# Altium schematic sheet sensor_connector.SchDoc
size A4; SheetNumber: 6; SheetTotal: 12
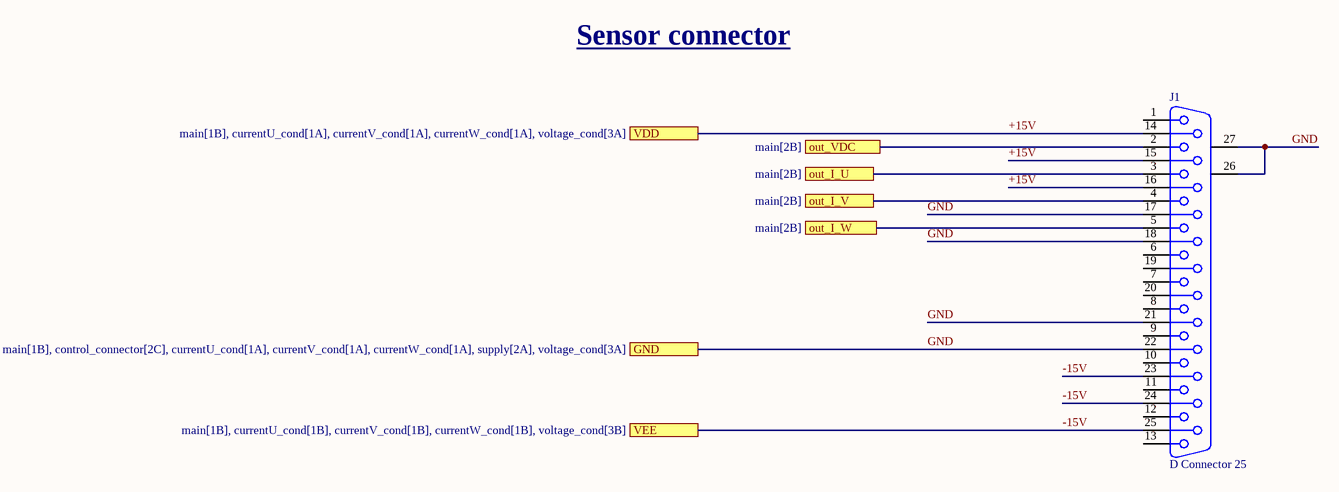
[diagram p0: sensor_connector.SchDoc]

## Parts
J1  D Connector 25  [DSUB1.385-2H25A_mod]

## Ports
GND (see main[1B], control_connector[2C], currentU_cond[1A], currentV_cond[1A], currentW_cond[1A], supply[2A], voltage_cond[3A]), out_I_U (see main[2B]), out_I_V (see main[2B]), out_I_W (see main[2B]), out_VDC (see main[2B]), VDD (see main[1B], currentU_cond[1A], currentV_cond[1A], currentW_cond[1A], voltage_cond[3A]), VEE (see main[1B], currentU_cond[1B], currentV_cond[1B], currentW_cond[1B], voltage_cond[3B])

## Nets
+15V: J1.14 J1.15 J1.16 ; port VDD
-15V: J1.23 J1.24 J1.25 ; port VEE
GND: J1.17 J1.18 J1.21 J1.22 J1.26(MH1) J1.27(MH2) ; port GND
out_I_U: J1.3 ; port out_I_U
out_I_V: J1.4 ; port out_I_V
out_I_W: J1.5 ; port out_I_W
out_VDC: J1.2 ; port out_VDC

Not connected (* = marked no-connect by the designer): J1 1 6 7 8 9 10 11 12 13 19 20

## Notes on the sheet
- Sensor connector

## Library data of the parts
J1 = D Connector 25: Receptacle Assembly, 25 Position, Right Angle; PackageDocument: U; Positions: 25; Published: 15-Jun-2001; LatestRevisionDate: 17-Jul-2002; LatestRevisionNote: Re-released for DXP Platform.; DatasheetDocument: 19-Mar-1999; PackageReference: 787202; Publisher: Altium Limited; Orientation: Right Angle; Gender: Receptacle